# Altium schematic sheet MCU A.SchDoc
size A4
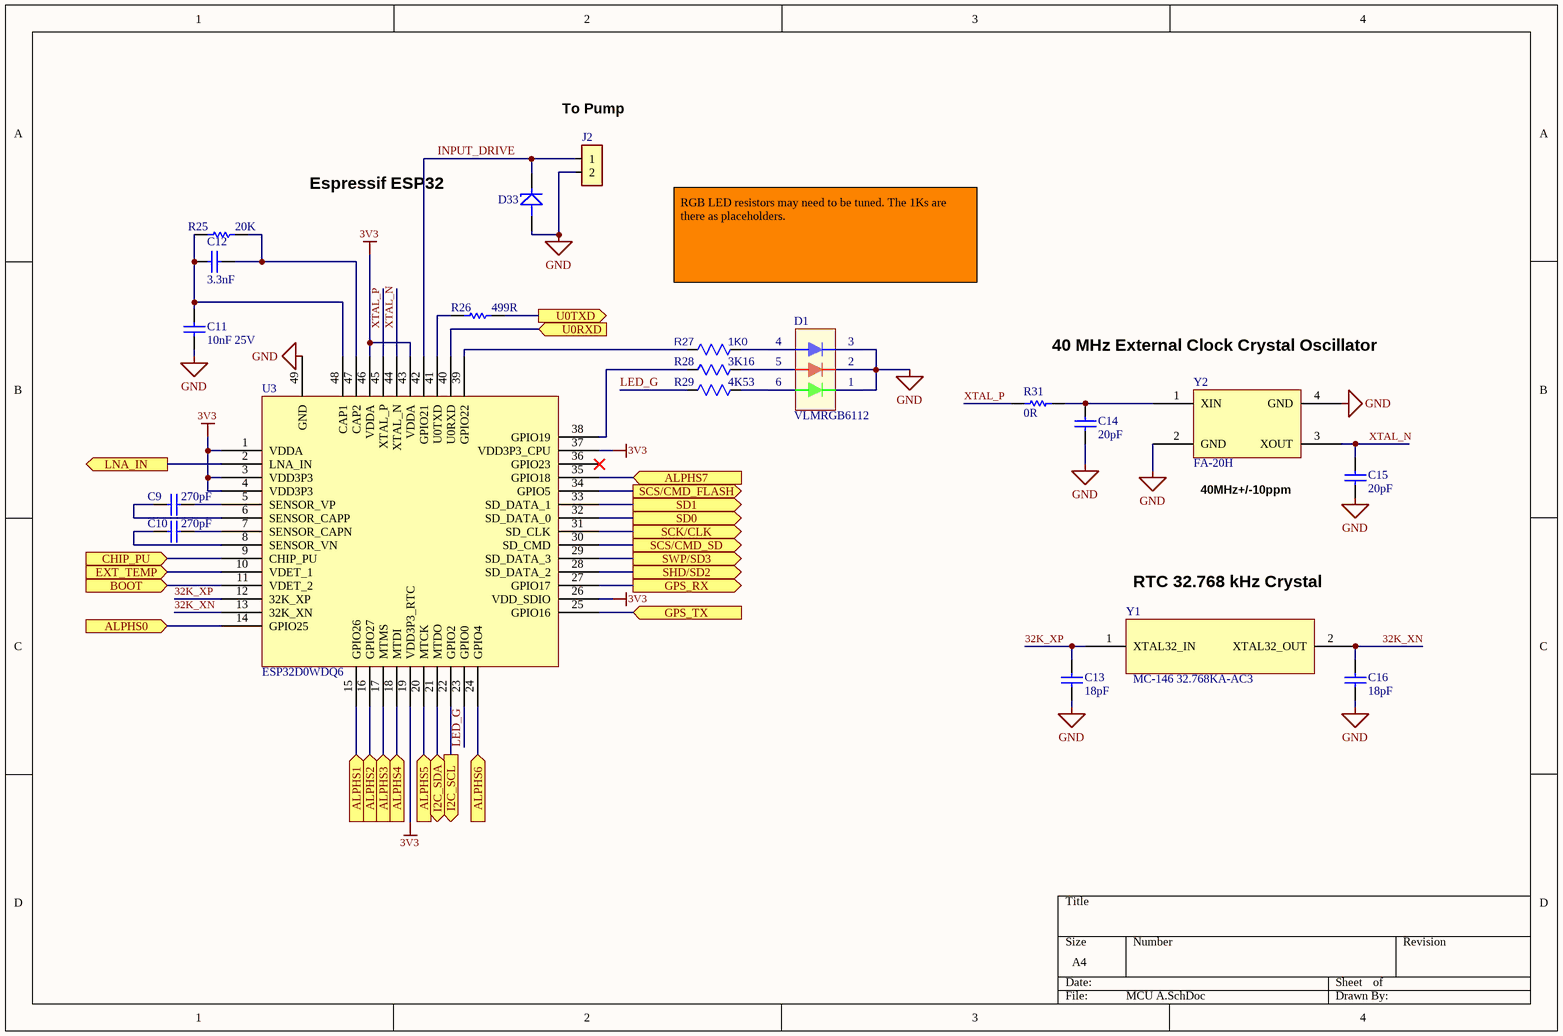
[diagram p0: MCU A.SchDoc]

## Parts
C9  270pF  [C1005[0402]]
C10  270pF  [C1005[0402]]
C11  10nF 25V  [C1005[0402]]
C12  3.3nF  [C1005[0402]]
C13  18pF  [C1005[0402]]
C14  20pF  [C1005[0402]]
C15  20pF  [C1005[0402]]
C16  18pF  [C1005[0402]]
D1  VLMRGB6112  [VLMRGB6112]
D33  3.3V TVS  [NXP PTVSxS1UR-Series (SOD123W)]  (value not drawn)
J2  To Pump  [6410/2pin]
R25  20K  [R1005[0402]]
R26  499R  [RESC1005X03N]
R27  1K0  [R1608[0603] small]
R28  3K16  [R1608[0603] small]
R29  4K53  [R1608[0603] small]
R31  0R  [RESC1005X03N]
U3  ESP32D0WDQ6  [QFN40P600X600X90_HS-49N]
Y1  MC-146 32.768KA-AC3  [MC-146]
Y2  FA-20H  [FA-20H]

## Ports
ALPHS0 (in), ALPHS1 (in), ALPHS2 (in), ALPHS3 (in), ALPHS4 (in), ALPHS5 (in), ALPHS6 (in), ALPHS7 (in), BOOT (in), CHIP_PU (in), EXT_TEMP (in), GPS_RX (out), GPS_TX (in), I2C_SCL (out), I2C_SDA (bidir), LNA_IN (out), SCK/CLK (out), SCS/CMD_FLASH (out), SCS/CMD_SD (out), SD0 (out), SD1 (out), SHD/SD2 (out), SWP/SD3 (out), U0RXD (in), U0TXD (out)

## Nets
3V3: U3.1(VDDA) U3.3(VDD3P3) U3.4(VDD3P3) U3.19(VDD3P3_RTC) U3.26(VDD_SDIO) U3.37(VDD3P3_CPU) U3.43(VDDA) U3.46(VDDA)
GND: C11.1 C13.1 C14.1 C15.1 C16.1 D1.1(A2) D1.2(C3) D1.3(A3) D33.2 J2.2 U3.49(GND) Y2.2(GND) Y2.4(GND)
32K_XN: C16.2 U3.13(32K_XN) Y1.2(XTAL32_OUT)
32K_XP: C13.2 U3.12(32K_XP) Y1.1(XTAL32_IN)
ALPHS0: U3.14(GPIO25) ; port ALPHS0
ALPHS1: U3.15(GPIO26) ; port ALPHS1
ALPHS2: U3.16(GPIO27) ; port ALPHS2
ALPHS3: U3.17(MTMS) ; port ALPHS3
ALPHS4: U3.18(MTDI) ; port ALPHS4
ALPHS5: U3.20(MTCK) ; port ALPHS5
ALPHS6: U3.24(GPIO4) ; port ALPHS6
ALPHS7: U3.35(GPIO18) ; port ALPHS7
BOOT: U3.11(VDET_2) ; port BOOT
CHIP_PU: U3.9(CHIP_PU) ; port CHIP_PU
EXT_TEMP: U3.10(VDET_1) ; port EXT_TEMP
GPS_RX: U3.27(GPIO17) ; port GPS_RX
GPS_TX: U3.25(GPIO16) ; port GPS_TX
I2C_SCL: U3.22(GPIO2) ; port I2C_SCL
I2C_SDA: U3.21(MTDO) ; port I2C_SDA
INPUT_DRIVE: D33.1 J2.1 U3.42(GPIO21)
LED_G: R29.1 U3.23(GPIO0)
LNA_IN: U3.2(LNA_IN) ; port LNA_IN
SCK/CLK: U3.31(SD_CLK) ; port SCK/CLK
SCS/CMD_FLASH: U3.34(GPIO5) ; port SCS/CMD_FLASH
SCS/CMD_SD: U3.30(SD_CMD) ; port SCS/CMD_SD
SD0: U3.32(SD_DATA_0) ; port SD0
SD1: U3.33(SD_DATA_1) ; port SD1
SHD/SD2: U3.28(SD_DATA_2) ; port SHD/SD2
SWP/SD3: U3.29(SD_DATA_3) ; port SWP/SD3
U0RXD: U3.40(U0RXD) ; port U0RXD
U0TXD: R26.2 ; port U0TXD
XTAL_N: C15.2 U3.44(XTAL_N) Y2.3(XOUT)
XTAL_P: R31.1 U3.45(XTAL_P)
NetC9_1: C9.1 U3.5(SENSOR_VP)
NetC9_2: C9.2 U3.6(SENSOR_CAPP)
NetC10_1: C10.1 U3.7(SENSOR_CAPN)
NetC10_2: C10.2 U3.8(SENSOR_VN)
NetC11_2: C11.2 C12.2 R25.1 U3.48(CAP1)
NetC12_1: C12.1 R25.2 U3.47(CAP2)
NetC14_2: C14.2 R31.2 Y2.1(XIN)
NetD1_4: D1.4(C1) R27.2
NetD1_5: D1.5(C1) R28.2
NetD1_6: D1.6(C1) R29.2
NetR26_1: R26.1 U3.41(U0TXD)
NetR27_1: R27.1 U3.39(GPIO22)
NetR28_1: R28.1 U3.38(GPIO19)

Not connected (* = marked no-connect by the designer): U3 36(GPIO23)*

## Notes on the sheet
- Espressif ESP32
- RGB LED resistors may need to be tuned. The 1Ks are there as placeholders.
- 40 MHz External Clock Crystal Oscillator
- (near Y2) 40MHz+/-10ppm
- RTC 32.768 kHz Crystal

## Library data of the parts
C9 C10 = 270pF_0402_50V: Cap,270pF,50V,10%,X7R,0402; Manufacturer Part Number: CL05B271KB5NNNC; Manufacturer: Samsung Electro-Mechanics; Supplier 1: Digi-Key; Supplier Part Number 1: 1276-1236-1-ND
C11 = 10nF_0402_25V: Cap,SMD,10nF,25V,10%,X7R,0402; Manufacturer Part Number: CL05B103KA5NNNC; Manufacturer: Samsung Electro-Mechanics; Supplier 1: Digi-Key; Supplier Part Number 1: 1276-1057-1-ND
C12 = 3.3nF_0402_16V: Cap,3.3nF,16V,10%,X7R,0402; Manufacturer Part Number: CC0402KRX7R7BB332; Manufacturer: Yageo; Supplier 1: Digi-Key; Supplier Part Number 1: 311-3803-1-ND
C13 C16 = 18pF_0402_50V: Cap,18pF,50V,5%,C0G/NP0,0402; Manufacturer Part Number: CC0402JRNPO9BN180; Manufacturer: Yageo; Supplier 1: Digi-Key; Supplier Part Number 1: 311-1415-1-ND
C14 C15 = 20pF_0402_50V: Cap,20pF,50V,5%,C0G/NP0,0402; Manufacturer Part Number: CC0402JRNPO9BN200; Manufacturer: Yageo; Supplier 1: Digi-Key; Supplier Part Number 1: 311-1417-1-ND
D1 = VLMRGB6112: LED RGB Clear 624nm/526nm/469nm 2V/3.1V/3V PLCC-6; Manufacturer: Vishay Semiconductor Opto Division; Manufacturer Part Number: VLMRGB6112-00-GS08; TZOA PN: 250-00002; Supplier 1: Digi-Key; Supplier Part Number 1: VLMRGB6112-00-GS08CT-ND
D33 = NXP PTVSxS1UR-Series: Manufacturer: Nexperia; Manufacturer Part Number: PTVS3V3S1UTR,115; Supplier 1: Digi-Key; Supplier Part Number 1: 1727-1416-1-ND
J2 = CON2: Connector 2 pin; Manufacturer: Molex; Manufacturer Part Number: 0022232023; Supplier 1: Digi-Key; Supplier Part Number 1: WM19468-ND
R25 = Res1: Resistor; Manufacturer: Panasonic; Manufacturer Part Number: ERJ-2GEJ203X; Value: 20K; Supplier Part Number 1: P20KJDKR-ND; Supplier 1: Digi-Key
R26 = Res1: Resistor; Manufacturer Part Number: ERJ-2RKF4990X; Manufacturer: Panasonic; Value: 499R; Supplier 1: Digi-Key; Supplier Part Number 1: P499LCT-ND
R27 = 1K00_0603_0.1W: RES 1K Ohm ±5%, 0.25W,1/4W 0603; Manufacturer: Rohm; Manufacturer Part Number: ESR03EZPJ102; TZOA PN: 209-00007; Product Training Modules: Resistor Products Overview; Featured Product: ROHM Chip Resistors; EDA / CAD Models: Download from Accelerated Designs; Temperature Coefficient: ±200ppm/°C; Online Catalog: ESR03 Series; Other Names: RHM1.0KDDKR; Supplier 1: Digi-Key; Stock 1: 63701; Pricing 1: 1=0.11, 10=0.098, 100=0.0378, 1000=0.0166, 2500=0.0144 (USD); Standard Package: 1; Category: Resistors; Family: Chip Resistor - Surface Mount; Series: ESR; Packaging: Cut Tape (CT); Resistance (Ohms): 1k; Tolerance: ±5%; Power (Watts): 0.25W, 1/4W; Composition: Thick Film; Features: Automotive AEC-Q200, Pulse Withstanding; Operating Temperature: -55°C ~ 155°C; Package / Case: 0603 (1608 Metric); Supplier Device Package: 0603 (1608 Metric); Size / Dimension: 0.063" L x 0.031" W (1.60mm x 0.80mm); Height: 0.022" (0.55mm); Number of Terminations: 2; ComponentLink1URL: https://datasheet.ciiva.com/2469/esr-2469603.pdf; ComponentLink1Description: https://datasheet.ciiva.com/2469/esr-2469603.pdf; ComponentLink2URL: https://datasheet.ciiva.com/2469/esr-2469604.pdf; ComponentLink2Description: https://datasheet.ciiva.com/2469/esr-2469604.pdf; ComponentLink3URL: https://datasheet.ciiva.com/2469/esr-2469605.pdf; ComponentLink3Description: https://datasheet.ciiva.com/2469/esr-2469605.pdf; Supplier Part Number 1: RHM1.0KDCT-ND
R28 = 3K16_Resistor_0603: Res,SMD,1/10W,3K16,0603,1%; Manufacturer: Stackpole Electronics; Manufacturer Part Number: RMCF0603FT3K16; Supplier 2: Arrow; Supplier 1: Digi-Key; Supplier Part Number 2: RMCF0603FT3K16; Supplier Part Number 1: RMCF0603FT3K16CT-ND
R29 = 4K53_Resistor_0603: Res,SMD,4K53,1/10W,1%,0603; Manufacturer: Yageo; Manufacturer Part Number: RC0603FR-074K53L; Supplier 2: Arrow; Supplier 1: Digi-Key; Supplier Part Number 2: RC0603FR-074K53L; Supplier Part Number 1: 311-4.53KHRCT-ND
R31 = Res1: Resistor; Manufacturer Part Number: ERJ-2GE0R00X; Manufacturer: Panasonic; Published: 8-Jun-2000; LatestRevisionDate: 17-Jul-2002; LatestRevisionNote: Re-released for DXP Platform.; PackageReference: AXIAL-0.3; Publisher: Altium Limited; PackageDescription: Axial Device, Thru-Hole; 2 Leads; 0.3 in Pin Spacing; Value: 0R; Supplier Part Number 1: P0.0JCT-ND; Supplier 1: Digi-Key
U3 = ESP32: Microcontroller; Manufacturer: Espressif Systems; Manufacturer Part Number: ESP32-D0WDQ6; Supplier Part Number 1: 1904-1004-1-ND; Supplier 1: Digi-Key
Y1 = MC-146 32.768KA-AC3: 32.768 kHz Crystal; Manufacturer: EPSON; Manufacturer Part Number: MC-146 32.768KA-AC3:ROHS; Supplier Part Number 1: SER2416CT-ND; Supplier 1: Digi-Key
Y2 = Y1: 40MHz Crystal Oscillator; Manufacturer: EPSON; Manufacturer Part Number: FA-20H 40.0000MF10Z-K3; Supplier Part Number 1: SER4045CT-ND; Supplier 1: Digi-Key